# Altium schematic sheet ClkGeneration.SchDoc: CLK Generators
size 420 x 297 mm; CheckedBy: T.Janicki; CompanyName: Creotech Instruments SA; DrawnBy: Greg Kasprowicz; Organization: CERN; Address1: European Organization for Nuclear Research; Address2: CH-1211 Geneve 23 - Switzerland; DocumentNumber: 10; Revision: -; SheetNumber: 4; SheetTotal: 15; EDA_Number: EDA-xxxx; Projet: Simple VME FMC Carrier; CreateDate: 20/11/2012; CheckedDate: 23/01/2012; DivGrp: BE-CO; Designer: G.Kasprowicz; DocumentName: ClkGeneration.SchDoc; ModifiedDate: -; Rule: PcbType=ProtelPcb
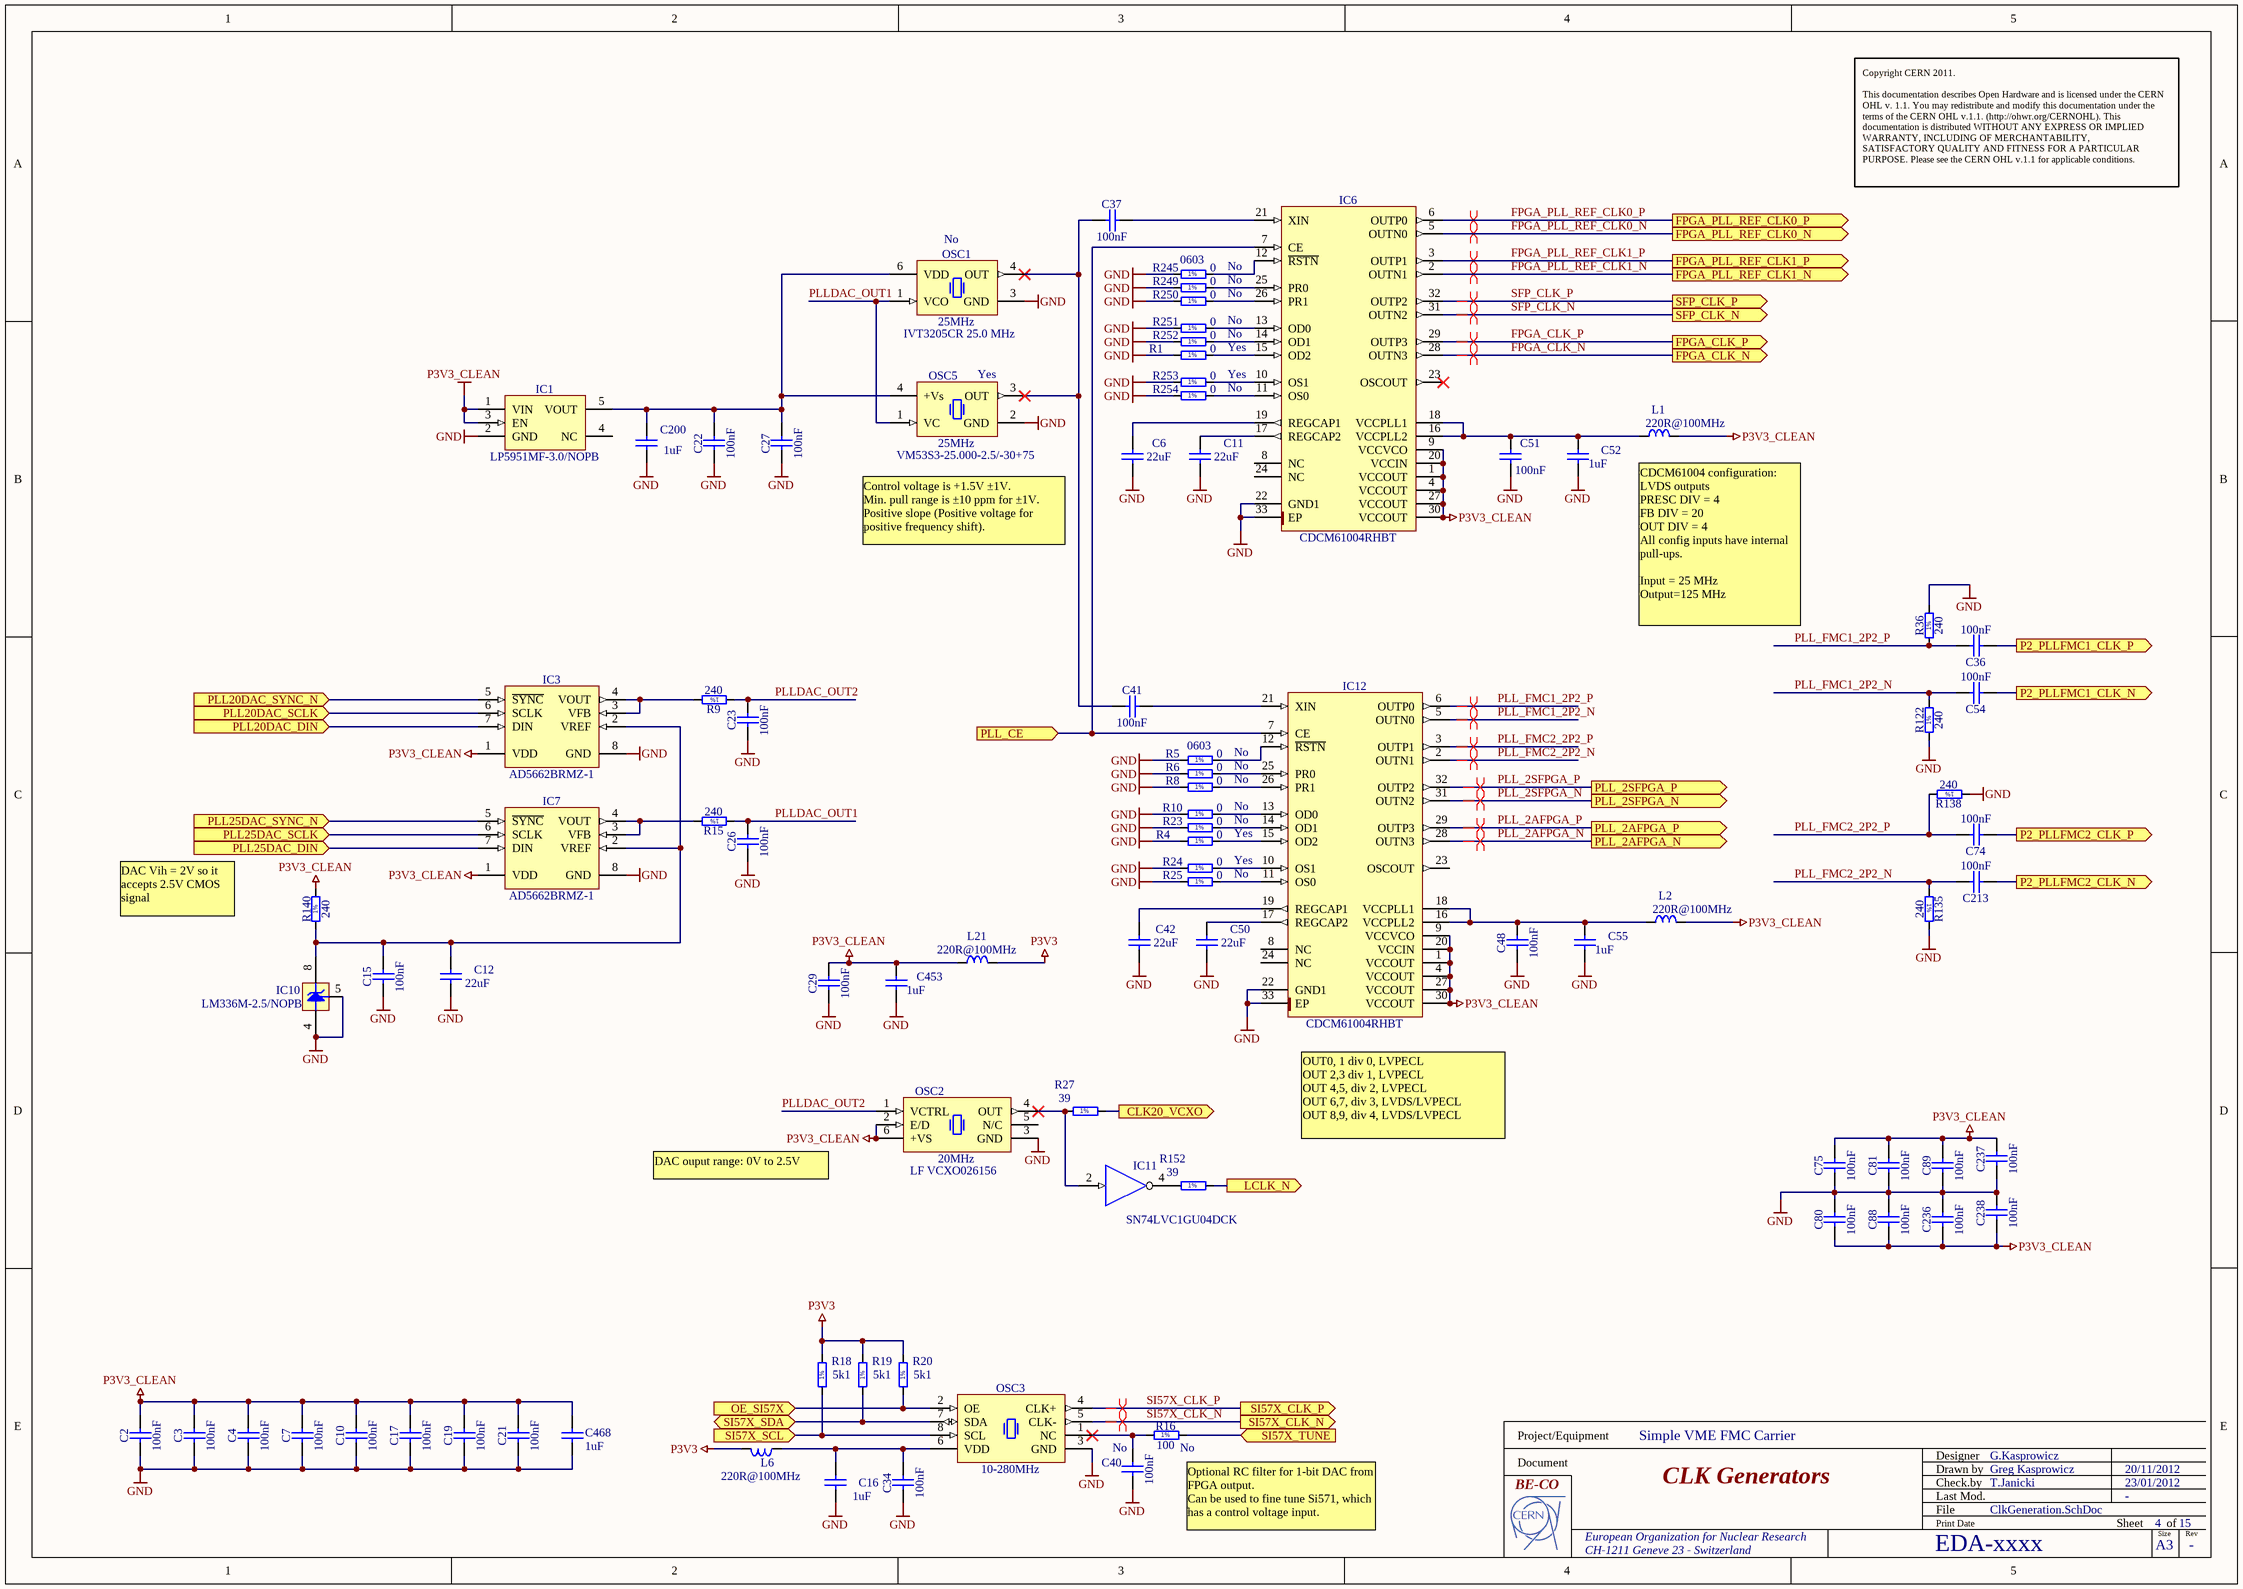
[diagram p0: ClkGeneration.SchDoc]

## Parts
C2  100nF  [CAPC1005X55N]
C3  100nF  [CAPC1005X55N]
C4  100nF  [CAPC1005X55N]
C6  22uF  [CAPC3216X180N]
C7  100nF  [CAPC1005X55N]
C10  100nF  [CAPC1005X55N]
C11  22uF  [CAPC3216X180N]
C12  22uF  [CAPC3216X180N]
C15  100nF  [CAPC1005X55N]
C16  1uF  [CAPC1608X87N]
C17  100nF  [CAPC1005X55N]
C19  100nF  [CAPC1005X55N]
C21  100nF  [CAPC1005X55N]
C22  100nF  [CAPC1005X55N]
C23  100nF  [CAPC1005X55N]
C26  100nF  [CAPC1005X55N]
C27  100nF  [CAPC1005X55N]
C29  100nF  [CAPC1005X55N]
C34  100nF  [CAPC1005X55N]
C36  100nF  [CAPC1005X55N]
C37  100nF  [CAPC1005X55N]
C40  100nF  Mounted: No  [CAPC1005X55N]
C41  100nF  [CAPC1005X55N]
C42  22uF  [CAPC3216X180N]
C48  100nF  [CAPC1005X55N]
C50  22uF  [CAPC3216X180N]
C51  100nF  [CAPC1005X55N]
C52  1uF  [CAPC1608X87N]
C54  100nF  [CAPC1005X55N]
C55  1uF  [CAPC1608X87N]
C74  100nF  [CAPC1005X55N]
C75  100nF  [CAPC1005X55N]
C80  100nF  [CAPC1005X55N]
C81  100nF  [CAPC1005X55N]
C88  100nF  [CAPC1005X55N]
C89  100nF  [CAPC1005X55N]
C200  1uF  [CAPC1608X87N]
C213  100nF  [CAPC1005X55N]
C236  100nF  [CAPC1005X55N]
C237  100nF  [CAPC1005X55N]
C238  100nF  [CAPC1005X55N]
C453  1uF  [CAPC1608X87N]
C468  1uF  [CAPC1608X87N]
IC1  LP5951MF-3.0/NOPB  [SOT95P284X122-5N]
IC3  AD5662BRMZ-1  [SOP65P490X110-8N]
IC6  CDCM61004RHBT  [QFN50P500X500X100-33N-S355]
IC7  AD5662BRMZ-1  [SOP65P490X110-8N]
IC10  LM336M-2.5/NOPB  [SOIC127P600X175-8N]
IC11  SN74LVC1GU04DCK  [SOT65P210X110-5N]
IC12  CDCM61004RHBT  [QFN50P500X500X100-33N-S355]
L1  220R@100MHz  [INDC2012X105N]
L2  220R@100MHz  [INDC2012X105N]
L6  220R@100MHz  [INDC2012X105N]
L21  220R@100MHz  [INDC2012X105N]
OSC1  25MHz  Manufacturer Part Number: IVT3205CR 25.0 MHz  Mounted: No  [OSC_RAKON_IVT3200C]
OSC2  20MHz  Manufacturer Part Number: LF VCXO026156  [OSC_IQD_CFPV-45]
OSC3  10-280MHz  [OSC_SILICON-LAB_SI570]
OSC5  25MHz  Manufacturer Part Number: VM53S3-25.000-2.5/-30+75  Mounted: Yes  [OSCCC320X500X160-4N]
R1  0  Mounted: Yes  [RESC1608X55N]
R4  0  Mounted: Yes  [RESC1608X55N]
R5  0  Case: 0603  Mounted: No  [RESC1608X55N]
R6  0  Mounted: No  [RESC1608X55N]
R8  0  Mounted: No  [RESC1608X55N]
R9  240  [RESC1608X55N]
R10  0  Mounted: No  [RESC1608X55N]
R15  240  [RESC1608X55N]
R16  100  Mounted: No  [RESC1608X55N]
R18  5k1  [RESC1608X55N]
R19  5k1  [RESC1608X55N]
R20  5k1  [RESC1608X55N]
R23  0  Mounted: No  [RESC1608X55N]
R24  0  Mounted: Yes  [RESC1608X55N]
R25  0  Mounted: No  [RESC1608X55N]
R27  39  [RESC1608X55N]
R36  240  [RESC1608X55N]
R122  240  [RESC1608X55N]
R135  240  [RESC1608X55N]
R138  240  [RESC1608X55N]
R140  240  [RESC1608X55N]
R152  39  [RESC1608X55N]
R245  0  Case: 0603  Mounted: No  [RESC1608X55N]
R249  0  Mounted: No  [RESC1608X55N]
R250  0  Mounted: No  [RESC1608X55N]
R251  0  Mounted: No  [RESC1608X55N]
R252  0  Mounted: No  [RESC1608X55N]
R253  0  Mounted: Yes  [RESC1608X55N]
R254  0  Mounted: No  [RESC1608X55N]

## Ports
CLK20_VCXO (out), FPGA_CLK_N (out), FPGA_CLK_P (out), FPGA_PLL_REF_CLK0_N (out), FPGA_PLL_REF_CLK0_P (out), FPGA_PLL_REF_CLK1_N (out), FPGA_PLL_REF_CLK1_P (out), LCLK_N (out), OE_SI57X (in), P2_PLLFMC1_CLK_N (out), P2_PLLFMC1_CLK_P (out), P2_PLLFMC2_CLK_N (out), P2_PLLFMC2_CLK_P (out), PLL20DAC_DIN (in), PLL20DAC_SCLK (in), PLL20DAC_SYNC_N (in), PLL25DAC_DIN (in), PLL25DAC_SCLK (in), PLL25DAC_SYNC_N (in), PLL_2AFPGA_N (out), PLL_2AFPGA_P (out), PLL_2SFPGA_N (out), PLL_2SFPGA_P (out), PLL_CE (in), SFP_CLK_N (out), SFP_CLK_P (out), SI57X_CLK_N (out), SI57X_CLK_P (out), SI57X_SCL (in), SI57X_SDA (bidir), SI57X_TUNE (in)

## Nets
GND: C2.1 C3.1 C4.1 C6.1 C7.1 C10.1 C11.1 C12.1 C15.1 C16.1 C17.1 C19.1 C21.1 C22.1 C23.1 C26.1 C27.1 C29.1 C34.1 C40.1 C42.1 C48.1 C50.1 C51.1 C52.1 C55.1 C75.1 C80.2 C81.1 C88.2 C89.1 C200.1 C236.2 C237.1 C238.2 C453.1 C468.1 IC1.2(GND) IC3.8(GND) IC6.22(GND1) IC6.33(EP) IC7.8(GND) IC10.4(A) IC10.5(Adj) IC11.3(GND) IC12.22(GND1) IC12.33(EP) OSC1.3(GND) OSC2.3(GND) OSC3.3(GND) OSC5.2(GND) R1.1 R4.1 R5.1 R6.1 R8.1 R10.1 R23.1 R24.1 R25.1 R36.2 R122.1 R135.2 R138.1 R245.1 R249.1 R250.1 R251.1 R252.1 R253.1 R254.1
P3V3: IC11.5(VCC) L6.2 L21.2 R18.2 R19.2 R20.2
P3V3_CLEAN: C2.2 C3.2 C4.2 C7.2 C10.2 C17.2 C19.2 C21.2 C29.2 C75.2 C80.1 C81.2 C88.1 C89.2 C236.1 C237.2 C238.1 C453.2 C468.2 IC1.1(VIN) IC1.3(EN) IC3.1(VDD) IC6.1(VCCOUT) IC6.4(VCCOUT) IC6.9(VCCVCO) IC6.20(VCCIN) IC6.27(VCCOUT) IC6.30(VCCOUT) IC7.1(VDD) IC12.1(VCCOUT) IC12.4(VCCOUT) IC12.9(VCCVCO) IC12.20(VCCIN) IC12.27(VCCOUT) IC12.30(VCCOUT) L1.2 L2.2 L21.1 OSC2.2(E/D) OSC2.6(+VS) R140.2
CLK20_VCXO: R27.2 ; port CLK20_VCXO
FPGA_CLK_N: IC6.28(OUTN3) ; port FPGA_CLK_N
FPGA_CLK_P: IC6.29(OUTP3) ; port FPGA_CLK_P
FPGA_PLL_REF_CLK0_N: IC6.5(OUTN0) ; port FPGA_PLL_REF_CLK0_N
FPGA_PLL_REF_CLK0_P: IC6.6(OUTP0) ; port FPGA_PLL_REF_CLK0_P
FPGA_PLL_REF_CLK1_N: IC6.2(OUTN1) ; port FPGA_PLL_REF_CLK1_N
FPGA_PLL_REF_CLK1_P: IC6.3(OUTP1) ; port FPGA_PLL_REF_CLK1_P
LCLK_N: R152.2 ; port LCLK_N
OE_SI57X: OSC3.2(OE) R20.1 ; port OE_SI57X
P2_PLLFMC1_CLK_N: C54.1 ; port P2_PLLFMC1_CLK_N
P2_PLLFMC1_CLK_P: C36.1 ; port P2_PLLFMC1_CLK_P
P2_PLLFMC2_CLK_N: C213.1 ; port P2_PLLFMC2_CLK_N
P2_PLLFMC2_CLK_P: C74.1 ; port P2_PLLFMC2_CLK_P
PLL20DAC_DIN: IC3.7(DIN) ; port PLL20DAC_DIN
PLL20DAC_SCLK: IC3.6(SCLK) ; port PLL20DAC_SCLK
PLL20DAC_SYNC_N: IC3.5(~{SYNC}) ; port PLL20DAC_SYNC_N
PLL25DAC_DIN: IC7.7(DIN) ; port PLL25DAC_DIN
PLL25DAC_SCLK: IC7.6(SCLK) ; port PLL25DAC_SCLK
PLL25DAC_SYNC_N: IC7.5(~{SYNC}) ; port PLL25DAC_SYNC_N
PLL_2AFPGA_N: IC12.28(OUTN3) ; port PLL_2AFPGA_N
PLL_2AFPGA_P: IC12.29(OUTP3) ; port PLL_2AFPGA_P
PLL_2SFPGA_N: IC12.31(OUTN2) ; port PLL_2SFPGA_N
PLL_2SFPGA_P: IC12.32(OUTP2) ; port PLL_2SFPGA_P
PLL_CE: IC6.7(CE) IC12.7(CE) ; port PLL_CE
PLL_FMC1_2P2_N: C54.2 IC12.5(OUTN0) R122.2
PLL_FMC1_2P2_P: C36.2 IC12.6(OUTP0) R36.1
PLL_FMC2_2P2_N: C213.2 IC12.2(OUTN1) R135.1
PLL_FMC2_2P2_P: C74.2 IC12.3(OUTP1) R138.2
PLLDAC_OUT1: C26.2 OSC1.1(VCO) OSC5.1(VC) R15.1
PLLDAC_OUT2: C23.2 OSC2.1(VCTRL) R9.1
SFP_CLK_N: IC6.31(OUTN2) ; port SFP_CLK_N
SFP_CLK_P: IC6.32(OUTP2) ; port SFP_CLK_P
SI57X_CLK_N: OSC3.5(CLK-) ; port SI57X_CLK_N
SI57X_CLK_P: OSC3.4(CLK+) ; port SI57X_CLK_P
SI57X_SCL: OSC3.8(SCL) R18.1 ; port SI57X_SCL
SI57X_SDA: OSC3.7(SDA) R19.1 ; port SI57X_SDA
SI57X_TUNE: R16.2 ; port SI57X_TUNE
NetC6_2: C6.2 IC6.19(REGCAP1)
NetC11_2: C11.2 IC6.17(REGCAP2)
NetC12_2: C12.2 C15.2 IC3.2(VREF) IC7.2(VREF) IC10.8(C) R140.1
NetC16_2: C16.2 C34.2 L6.1 OSC3.6(VDD)
NetC22_2: C22.2 C27.2 C200.2 IC1.5(VOUT) OSC1.6(VDD) OSC5.4(+Vs)
NetC37_1: C37.1 C41.1 OSC1.4(OUT) OSC5.3(OUT)
NetC37_2: C37.2 IC6.21(XIN)
NetC40_2: C40.2 OSC3.1(NC) R16.1
NetC41_2: C41.2 IC12.21(XIN)
NetC42_2: C42.2 IC12.19(REGCAP1)
NetC48_2: C48.2 C55.2 IC12.16(VCCPLL2) IC12.18(VCCPLL1) L2.1
NetC50_2: C50.2 IC12.17(REGCAP2)
NetC51_2: C51.2 C52.2 IC6.16(VCCPLL2) IC6.18(VCCPLL1) L1.1
NetIC3_3: IC3.3(VFB) IC3.4(VOUT) R9.2
NetIC6_10: IC6.10(OS1) R253.2
NetIC6_11: IC6.11(OS0) R254.2
NetIC6_12: IC6.12(~{RSTN}) R245.2
NetIC6_13: IC6.13(OD0) R251.2
NetIC6_14: IC6.14(OD1) R252.2
NetIC6_15: IC6.15(OD2) R1.2
NetIC6_25: IC6.25(PR0) R249.2
NetIC6_26: IC6.26(PR1) R250.2
NetIC7_3: IC7.3(VFB) IC7.4(VOUT) R15.2
NetIC11_2: IC11.2(IN) OSC2.4(OUT) R27.1
NetIC11_4: IC11.4(OUT) R152.1
NetIC12_10: IC12.10(OS1) R24.2
NetIC12_11: IC12.11(OS0) R25.2
NetIC12_12: IC12.12(~{RSTN}) R5.2
NetIC12_13: IC12.13(OD0) R10.2
NetIC12_14: IC12.14(OD1) R23.2
NetIC12_15: IC12.15(OD2) R4.2
NetIC12_25: IC12.25(PR0) R6.2
NetIC12_26: IC12.26(PR1) R8.2

Not connected (* = marked no-connect by the designer): IC1 4(NC); IC6 8(NC) 23(OSCOUT)* 24(NC); IC12 8(NC) 23(OSCOUT) 24(NC); OSC2 5(N/C)

## Layout directives
differential pair: FPGA_CLK_N, FPGA_CLK_P, FPGA_PLL_REF_CLK0_N, FPGA_PLL_REF_CLK0_P, FPGA_PLL_REF_CLK1_N, FPGA_PLL_REF_CLK1_P, PLL_2AFPGA_N, PLL_2AFPGA_P, PLL_2SFPGA_N, PLL_2SFPGA_P, PLL_FMC1_2P2_N, PLL_FMC1_2P2_P, PLL_FMC2_2P2_N, PLL_FMC2_2P2_P, SFP_CLK_N, SFP_CLK_P, SI57X_CLK_N, SI57X_CLK_P

## Notes on the sheet
- Copyright CERN 2011.
  This documentation describes Open Hardware and is licensed under the CERN OHL v. 1.1. You may redistribute and modify this documentation under the terms of the CERN OHL v.1.1. (http://ohwr.org/CERNOHL). This documentation is distributed WITHOUT ANY EXPRESS OR IMPLIED WARRANTY, INCLUDING OF MERCHANTABILITY, SATISFACTORY QUALITY AND FITNESS FOR A PARTICULAR PURPOSE. Please see the CERN OHL v.1.1 for applicable conditions.
- Control voltage is +1.5V ±1V.
  Min. pull range is ±10 ppm for ±1V.
  Positive slope (Positive voltage for positive frequency shift).
- (near L1) CDCM61004 configuration:
  LVDS outputs
  PRESC DIV = 4
  FB DIV = 20
  OUT DIV = 4
  All config inputs have internal pull-ups.
  Input = 25 MHz
  Output=125 MHz
- DAC Vih = 2V so it accepts 2.5V CMOS signal
- (near IC12) OUT0, 1 div 0, LVPECL
  OUT 2,3 div 1, LVPECL
  OUT 4,5, div 2, LVPECL
  OUT 6,7, div 3, LVDS/LVPECL
  OUT 8,9, div 4, LVDS/LVPECL
- DAC ouput range: 0V to 2.5V
- (near R16) Optional RC filter for 1-bit DAC from FPGA output.
  Can be used to fine tune Si571, which has a control voltage input.
- Project/Equipment
- Document
- Designer
- Drawn by
- Check.by
- File
- Last Mod.
- Print Date
- Sheet
- Size
- A3
- of
- Rev
- (in symbol R0603_0R_JUMPER) 1%
- (in symbol R0603_5K1_1%_0.1W_100PPM) 1%
- (in symbol R0603_39R_1%_0.1W_100PPM) 1%
- (in symbol R0603_100R_1%_0.1W_100PPM) 1%
- (in symbol R0603_240R_1%_0.1W_100PPM) 1%

## Library data of the parts
C2-C4 C7 C10 C15 C17 C19 C21-C23 C26 C27 C29 C34 C36 C37 C40 C41 C48 C51 C54 C74 C75 C80 C81 C88 C89 C213 C236-C238 = CC0402_100NF_16V_10%_X7R: Non-polarised capacitor; Part Description: SMD Multilayer Chip Ceramic Capacitor; Manufacturer: GENERIC; Manufacturer1 Part Number: 223878715649; Voltage: 16V; TC: X7R; Tolerance: ±10%; Table: Capacitors SMD; Part Number: CC0402_100NF_16V_10%_X7R; Component Kind: Standard; Component Type: Standard; Pin Count: 2; Value: 100nF; Status: Not Recommended; Manufacturer Part Number: CC0402_100NF_16V_10%_X7R; Case: 0402; Socket: No; SMD: Yes; Manufacturer1 Example: PHYCOMP; Manufacturer1 ComponentHeight: 0.55mm; HelpURL: \\cern.ch\dfs\Applications\Altium\Datasheets\CC0402_X7R_PHYCOMP.pdf; Author: CERN DEM JLC
  C2-C4 C7 C10 C15 C17 C19 C21-C23 C26 C27 C29 C34 C37 C41 C48 C51 C75 C80 C81 C88 C89 C236-C238: Mounted: Yes; CreateDate: 2007-12-03; LatestRevisionDate: 2007-12-03
  C36 C54 C74 C213: Mounted: Yes; CreateDate: 03/12/2007; LatestRevisionDate: 03/12/2007
  C40: CreateDate: 2007-12-03; LatestRevisionDate: 2007-12-03
C6 C11 C12 C42 C50 = CC1206_22UF_10V_10%_X7R: Non-polarised capacitor; Part Description: SMD Multilayer Chip Ceramic Capacitor; Manufacturer: GENERIC; Manufacturer1 Part Number: GRM31CR71A226KE15L; Voltage: 10V; TC: X7R; Tolerance: ±10%; Table: Capacitors SMD; Part Number: CC1206_22UF_10V_10%_X7R; Component Kind: Standard; Component Type: Standard; Pin Count: 2; Value: 22uF; Status: Preferred; Manufacturer Part Number: CC1206_22UF_10V_10%_X7R; Case: 1206; Mounted: Yes; Socket: No; SMD: Yes; Manufacturer1 Example: MURATA; Manufacturer1 ComponentHeight: 1.8mm; HelpURL: \\cern.ch\dfs\Applications\Altium\Datasheets\CC1206_X7R_MURATA_GRM-HI-CAP.pdf; Author: CERN DEM JLC; CreateDate: 2010-06-08; LatestRevisionDate: 2010-06-08
C16 C200 C468 = CC0603_1UF_16V_10%_X7R: Non-polarised capacitor; Part Description: SMD Multilayer Chip Ceramic Capacitor; Manufacturer: GENERIC; Manufacturer1 Part Number: 223824613663; Voltage: 16V; TC: X7R; Tolerance: ±10%; Table: Capacitors SMD; Part Number: CC0603_1UF_16V_10%_X7R; Component Kind: Standard; Component Type: Standard; Pin Count: 2; Value: 1uF; Status: Preferred; Manufacturer Part Number: CC0603_1uF_16V_10%_X7R; Case: 0603; Mounted: Yes; Socket: No; SMD: Yes; Manufacturer1 Example: PHYCOMP; Manufacturer1 ComponentHeight: 0.87mm; HelpURL: \\cern.ch\dfs\Applications\Altium\Datasheets\CC0805_X5R_PHYCOMP_HC.pdf; Author: CERN DEM JLC; CreateDate: 03/12/2007; LatestRevisionDate: 03/12/2007
C52 C55 C453 = CC0603_1UF_16V_10%_X7R: Non-polarised capacitor; Part Description: SMD Multilayer Chip Ceramic Capacitor; Manufacturer: GENERIC; Manufacturer1 Part Number: 223824613663; Manufacturer1 Datasheet: \\cern.ch\dfs\Applications\Altium\Datasheets\CC0805_X5R_PHYCOMP_HC.pdf; Voltage: 16V; TC: X7R; Tolerance: ±10%; Table: Capacitors SMD; Part Number: CC0603_1UF_16V_10%_X7R; Component Kind: Standard; Component Type: Standard; Designator: Capacitor - non polarized; Library Reference: Capacitor - non polarized; Pin Count: 2; Value: 1uF; Status: Preferred; Manufacturer Part Number: CC0603_1uF_16V_10%_X7R; Case: 0603; Mounted: Yes; Socket: No; SMD: Yes; Manufacturer1 Example: PHYCOMP; Manufacturer1 ComponentHeight: 0.87mm; HelpURL: \\cern.ch\dfs\Applications\Altium\Datasheets\CC0805_X5R_PHYCOMP_HC.pdf; Author: CERN DEM JLC; CreateDate: 03/12/2007; LatestRevisionDate: 03/12/2007
IC1 = LP5951MF-3.0/NOPB: 150mA Micropower Low-Dropout CMOS Voltage Regulator; Part Description: 3V,  150mA Micropower Low-Dropout CMOS Voltage Regulator; Manufacturer: NATIONAL SEMICONDUCTOR; Table: Regulators; Part Number: LP5951MF-3.0/NOPB; Component Kind: Standard; Component Type: Standard; Device: LP5951MF-3.0/NOPB; PackageDescription: SOT23 5, Pitch 0.95mm - Body 1.67x2.99mm, IPC Medium Density; Manufacturer Part Number: LP5951MF-3.0/NOPB; Pin Count: 5; Case: SOT23-5; Mounted: Yes; Socket: No; SMD: Yes; ComponentHeight: 1.19mm; HelpURL: \\cern.ch\dfs\Applications\Altium\Datasheets\LP5951MF-3.0-NOPB.pdf; Author: CERN DEM JLC; CreateDate: 24/01/2011; LatestRevisionDate: 24/01/2011
IC3 IC7 = AD5662BRMZ-1: 2.7V to 5.5V, 250uA, Rail-to-Rail Output 16-Bit nanoDAC; Manufacturer: ANALOG DEVICES; Table: Analog & Interface; Part Number: AD5662BRMZ-1; Component Kind: Standard; Component Type: Standard; Device: AD5662BRMZ-1; PackageDescription: SOP, 8-Leads, Body 3.0x3.0mm, Pitch 0.65mm, IPC Medium Density; Part Description: 2.7V to 5.5V, 250uA, Rail-to-Rail Output 16-Bit nanoDAC; Manufacturer Part Number: AD5662BRMZ-1; Pin Count: 8; Case: MSOP8; Mounted: Yes; Socket: No; SMD: Yes; ComponentHeight: 1.1mm; Author: CERN DEM JLC; HelpURL: \\cern.ch\dfs\Applications\Altium\Datasheets\AD5662BRMZ-1.pdf; CreateDate: 1/10/2011; LatestRevisionDate: 1/10/2011
IC6 IC12 = CDCM61004RHBT: Four Output, Integrated VCO, Low-Jitter Clock Generator; Manufacturer: TEXAS INSTRUMENTS; Table: Analog & Interface; Part Number: CDCM61004RHBT; Component Kind: Standard; Component Type: Standard; Device: CDCM61004RHBT; PackageDescription: QFN, (MO-220-VHHD-4) 0.50mm pitch,square; 8 pin X 8 pin, 5mm X 5mm X 1.00mm H body (w/thermal tab 3.5 X 3.5mm),  IPC Medium Density; Part Description: Four Output, Integrated VCO, Low-Jitter Clock Generator; Manufacturer Part Number: CDCM61004RHBT; Pin Count: 33; Case: QFN32; Mounted: Yes; Socket: No; SMD: Yes; ComponentHeight: 1mm; Author: CERN DEM JLC; HelpURL: \\cern.ch\dfs\Applications\Altium\Datasheets\CDCM61004RHBT.pdf; CreateDate: 2010-08-25; LatestRevisionDate: 2010-08-25
IC10 = LM336M-2.5/NOPB: Reference Diode; Part Description: 2.5V Voltage Reference Diode; Manufacturer: NATIONAL SEMICONDUCTOR; Table: Regulators; Part Number: LM336M-2.5/NOPB; Component Kind: Standard; Component Type: Standard; Device: LM336M-2.5/NOPB; PackageDescription: SOIC 8, Pitch 1.27mm - Body 4x5mm, IPC Medium Density; Manufacturer Part Number: LM336M-2.5/NOPB; Pin Count: 3; Case: SOIC8; Mounted: Yes; Socket: No; SMD: Yes; ComponentHeight: 1.75mm; HelpURL: \\cern.ch\dfs\Applications\Altium\Datasheets\LM336M-2.5-NOPB.pdf; Author: CERN DEM JLC; CreateDate: 2010-04-12; LatestRevisionDate: 2010-04-12
IC11 = SN74LVC1GU04DCK: Single Inverter Buffer; Part Description: Single Inverter Gate; Manufacturer: TEXAS INSTRUMENTS; Table: Standard Logic; Part Number: SN74LVC1GU04DCK; Component Kind: Standard; Component Type: Standard; Device: SN74LVC1GU04DCK; PackageDescription: SOT353, SC70-5, SOT, 0.65mm Pitch, 5 pin, 1.25mm W X 2.00mm L X 1.10mm H, IPC Medium Density; Manufacturer Part Number: SN74LVC1GU04DCK; Pin Count: 2; Case: SOT353; Mounted: Yes; Socket: No; SMD: Yes; ComponentHeight: 1.1mm; Author: CERN DEM JLC; HelpURL: \\cern.ch\dfs\Applications\Altium\Datasheets\SN74LVC1GU04DCK.pdf; CreateDate: 2011-02-16; LatestRevisionDate: 2011-02-16
L1 L2 L6 L21 = IND0805_MURATA_BLM21PG221SN1D: Inductor; Part Description: SMD EMIFIL Suppression Chip Bead Ferrite; Manufacturer: MURATA; Power: 2A; Resistance: 0.05R; Tolerance: ±25%; Table: Inductors SMD; Part Number: IND0805_MURATA_BLM21PG221SN1D; Component Kind: Standard; Component Type: Standard; Pin Count: 2; Value: 220R@100MHz; Status: None; Manufacturer Part Number: BLM21PG221SN1D; Case: 0805; Mounted: Yes; Socket: No; SMD: Yes; ComponentHeight: 1.05mm; HelpURL: \\cern.ch\dfs\Applications\Altium\Datasheets\IND0402_MURATA_BLM21P.pdf; Author: CERN DEM JLC; CreateDate: 25/01/2010; LatestRevisionDate: 25/01/2010
OSC1 = OSC_25MHZ_RAKON_IVT3205CR: Oscillator 4 pins 1=VCO 3=GND 4=OUT 6=VDC; Part Description: 11pF 3.3V ±1ppm Surface Mount TCXO Voltage Controlled Oscillator (IT3200C Serie); Manufacturer: RAKON; Table: Crystals & Oscillators; Part Number: OSC_25MHZ_RAKON_IVT3205CR; Component Kind: Standard; Component Type: Standard; PackageDescription: Oscillator IVT3200C Serie, corner concave; 4 pin, 2.50mm L X 3.2mm W X 1.1mm H; Value: 25MHz; Pin Count: 4; Socket: No; SMD: Yes; ComponentHeight: 1.1mm; HelpURL: \\cern.ch\dfs\Applications\Altium\Datasheets\OSC_RAKON_IVT3200C.pdf; Author: CERN DEM JLC; CreateDate: 08/02/2010; LatestRevisionDate: 08/02/2010
OSC2 = OSC_20MHZ_IQD_LF VCXO026156: 3.3V ±100ppm 15pF HCMOS Tri-State Surface Mount Voltage Controlled Oscillator VCXO (CFPV-45 Serie); Manufacturer: IQD FREQUENCY PRODUCTS; Table: Crystals & Oscillators; Part Number: OSC_20MHZ_IQD_LF VCXO026156; Component Kind: Standard; Component Type: Standard; PackageDescription: SMD VCXO, side convave, 6 pins, 5.00x7.00mm (CFPV-45 Serie); Value: 20MHz; Part Description: 3.3V ±100ppm 15pF HCMOS Tri-State Surface Mount Voltage Controlled Oscillator VCXO (CFPV-45 Serie); Pin Count: 6; Mounted: Yes; Socket: No; SMD: Yes; ComponentHeight: 1.7mm; HelpURL: \\cern.ch\dfs\Applications\Altium\Datasheets\OSC_IQD_CFPV-45.pdf; Author: CERN DEM JLC; CreateDate: 1/24/2011; LatestRevisionDate: 1/24/2011
OSC3 = OSC_10-280MHZ_SILICON-LAB_Si570BBC000121DG: Any-Rate I2C Programmable XO Oscillator Si570 Serie; Part Description: 10-280MHz 3.3V ±20ppm LVDS Any-Rate I2C Programmable XO Oscillator Si570 Serie; Manufacturer: SILICON LABS; Table: Crystals & Oscillators; Part Number: OSC_10-280MHZ_SILICON-LAB_Si570BBC000121DG; Component Kind: Standard; Component Type: Standard; PackageDescription: Oscillator Si570 Serie, 8 pins, 5x7mm; Value: 10-280MHz; Manufacturer Part Number: 570BBC000121DG; Pin Count: 8; Mounted: Yes; Socket: No; SMD: Yes; ComponentHeight: 1.85mm; HelpURL: \\cern.ch\dfs\Applications\Altium\Datasheets\OSC_SILICON-LAB_SI570.pdf; Author: CERN DEM JLC; CreateDate: 2010-02-09; LatestRevisionDate: 2010-02-09
OSC5 = OSC_25MHZ_MERCURY_VM53S3-25.000-2.5/-30+75: Oscillator 4 pins 1=VC 2=GND 3=OUT 4=+Vs; Part Description: 3V ±2.5ppmVoltage Controlled Temperature Compensated Crystal Oscillator VM53S3 Serie; Manufacturer: MERCURY ELECTRONICS; Table: Crystals & Oscillators; Part Number: OSC_25MHZ_MERCURY_VM53S3-25.000-2.5/-30+75; Component Kind: Standard; Component Type: Standard; PackageDescription: SMD Oscillator, Corner Convave, 4 pins, 5x3.2mm; Value: 25MHz; Pin Count: 4; Socket: No; SMD: Yes; ComponentHeight: 1.6mm; HelpURL: \\cern.ch\dfs\Applications\Altium\Datasheets\OSC_MERCURY_VM53S3.pdf; Author: CERN DEM JLC; CreateDate: 1/20/2010; LatestRevisionDate: 1/24/2011
R1 R4-R6 R8 R10 R23-R25 R245 R249-R254 = R0603_0R_JUMPER: Resistor - 1%; Part Description: 1A (0.05R Max DC Resistance) Zero Ohm Jumper; Manufacturer: GENERIC; Manufacturer1 Part Number: NRC06Z0; Table: Resistors SMD; Part Number: R0603_0R_JUMPER; Component Kind: Standard; Component Type: Standard; Pin Count: 2; Value: 0; Status: Preferred; Manufacturer Part Number: R0603_0R_JUMPER; Socket: No; SMD: Yes; Manufacturer1 Example: NIC COMPONENT; Manufacturer1 ComponentHeight: 0.55mm; HelpURL: \\cern.ch\dfs\Applications\Altium\Datasheets\R0603_NIC_NRC.pdf; Author: CERN DEM JLC; CreateDate: 2007-12-03; LatestRevisionDate: 2008-03-13
  R1 R4 R6 R8 R10 R23-R25 R249-R254: Case: 0603
R9 R15 R36 R122 R135 R138 R140 = R0603_240R_1%_0.1W_100PPM: Resistor - 1%; Part Description: General Purpose Thick Film Chip Resistor; Manufacturer: GENERIC; Manufacturer1 Part Number: NRC06F2400TRF; Power: 0.1W; TC: ±100ppm/°C; Table: Resistors SMD; Part Number: R0603_240R_1%_0.1W_100PPM; Component Kind: Standard; Component Type: Standard; Pin Count: 2; Value: 240; Status: Preferred; Tolerance: ±1%; Manufacturer Part Number: R0603_240R_1%_0.1W_100PPM; Case: 0603; Mounted: Yes; Socket: No; SMD: Yes; Manufacturer1 Example: NIC COMPONENT; Manufacturer1 ComponentHeight: 0.55mm; HelpURL: \\cern.ch\dfs\Applications\Altium\Datasheets\R0603_NIC_NRC.pdf; Author: CERN DEM JLC; CreateDate: 12/3/2007; LatestRevisionDate: 3/13/2008
R16 = R0603_100R_1%_0.1W_100PPM: Resistor - 1%; Part Description: General Purpose Thick Film Chip Resistor; Manufacturer: GENERIC; Manufacturer1 Part Number: NRC06F4700TRF; Power: 0.1W; TC: ±100ppm/°C; Table: Resistors SMD; Part Number: R0603_100R_1%_0.1W_100PPM; Component Kind: Standard; Component Type: Standard; Pin Count: 2; Value: 100; Status: Preferred; Tolerance: ±1%; Manufacturer Part Number: R0603_100R_1%_0.1W_100PPM; Case: 0603; Socket: No; SMD: Yes; Manufacturer1 Example: NIC COMPONENT; Manufacturer1 ComponentHeight: 0.55mm; HelpURL: \\cern.ch\dfs\Applications\Altium\Datasheets\R0603_NIC_NRC.pdf; Author: CERN DEM JLC; CreateDate: 2007-12-03; LatestRevisionDate: 2008-03-13
R18-R20 = R0603_5K1_1%_0.1W_100PPM: Resistor - 1%; Part Description: General Purpose Thick Film Chip Resistor; Manufacturer: GENERIC; Manufacturer1 Part Number: NRC06F5101TRF; Power: 0.1W; TC: ±100ppm/°C; Table: Resistors SMD; Part Number: R0603_5K1_1%_0.1W_100PPM; Component Kind: Standard; Component Type: Standard; Pin Count: 2; Value: 5k1; Status: Preferred; Tolerance: ±1%; Manufacturer Part Number: R0603_5K1_1%_0.1W_100PPM; Case: 0603; Mounted: Yes; Socket: No; SMD: Yes; Manufacturer1 Example: NIC COMPONENT; Manufacturer1 ComponentHeight: 0.55mm; HelpURL: \\cern.ch\dfs\Applications\Altium\Datasheets\R0603_NIC_NRC.pdf; Author: CERN DEM JLC; CreateDate: 03/12/2007; LatestRevisionDate: 13/03/2008
R27 R152 = R0603_39R_1%_0.1W_100PPM: Resistor - 1%; Part Description: General Purpose Thick Film Chip Resistor; Manufacturer: GENERIC; Manufacturer1 Part Number: NRC06F39R0TRF; Power: 0.1W; TC: ±100ppm/°C; Table: Resistors SMD; Part Number: R0603_39R_1%_0.1W_100PPM; Component Kind: Standard; Component Type: Standard; Pin Count: 2; Value: 39; Status: Preferred; Tolerance: ±1%; Manufacturer Part Number: R0603_39R_1%_0.1W_100PPM; Case: 0603; Mounted: Yes; Socket: No; SMD: Yes; Manufacturer1 Example: NIC COMPONENT; Manufacturer1 ComponentHeight: 0.55mm; HelpURL: \\cern.ch\dfs\Applications\Altium\Datasheets\R0603_NIC_NRC.pdf; Author: CERN DEM JLC; CreateDate: 2007-12-03; LatestRevisionDate: 2008-03-13